# Altium schematic sheet Digital Isolation.SchDoc
size A4
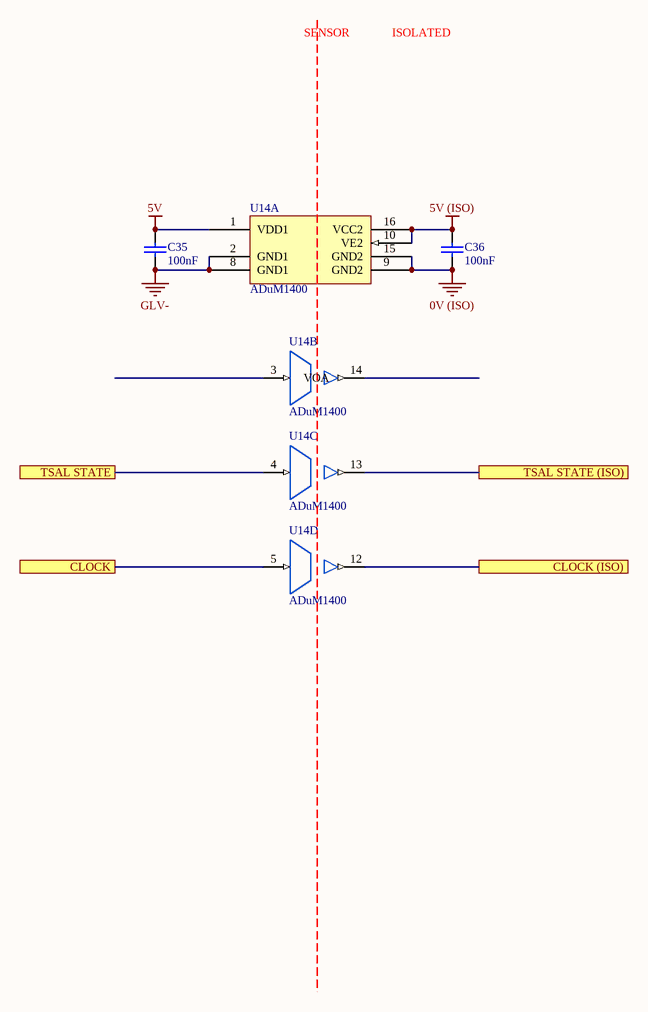
[diagram p0: Digital Isolation.SchDoc]

## Parts
C35  100nF  [0805]
C36  100nF  [0805]
U14  ADuM1400  [AD 16-SOIC]  (parts A,B,C,D of 5)

## Ports
CLOCK, CLOCK (ISO), TSAL STATE, TSAL STATE (ISO)

## Nets
0V (ISO): C36.1 U14.9(GND2) U14.15(GND2)
5V: C35.2 U14.1(VDD1)
5V (ISO): C36.2 U14.10(VE2) U14.16(VCC2)
GLV-: C35.1 U14.2(GND1) U14.8(GND1)
CLOCK: U14.5(VIC) ; port CLOCK
CLOCK (ISO): U14.12(VOC) ; port CLOCK (ISO)
TSAL STATE: U14.4(VIB) ; port TSAL STATE
TSAL STATE (ISO): U14.13(VOB) ; port TSAL STATE (ISO)

Not connected (* = marked no-connect by the designer): U14 3(VIA) 14(VOA)

## Notes on the sheet
- SENSOR
- ISOLATED

## Library data of the parts
C35 C36 = GCM21BR71E104KA37L: Manufacturer: muRata; Tolerance: 10%; Material: X7R; Rated Voltage: 25V; Part Number: GCM21BR71E104KA37L; Value: 100nF
U14 = ADuM1400: General Purpose Digital Isolator 2500Vrms 4 Channel 1Mbps 25kV/µs CMTI 16-SOIC (0.295", 7.50mm Width); Manufacturer: Analog Devices; Part Number: ADuM1400; Digikey Part Number: ADUM1400WSRWZ-ND; Digikey Link: https://www.digikey.com/product-detail/en/analog-devices-inc/ADUM1400WSRWZ/ADUM1400WSRWZ-ND/1873713